# Altium schematic sheet NCS_Wireless_Bed_Unit_DIP_Conn_Prog_conn.SchDoc
size A
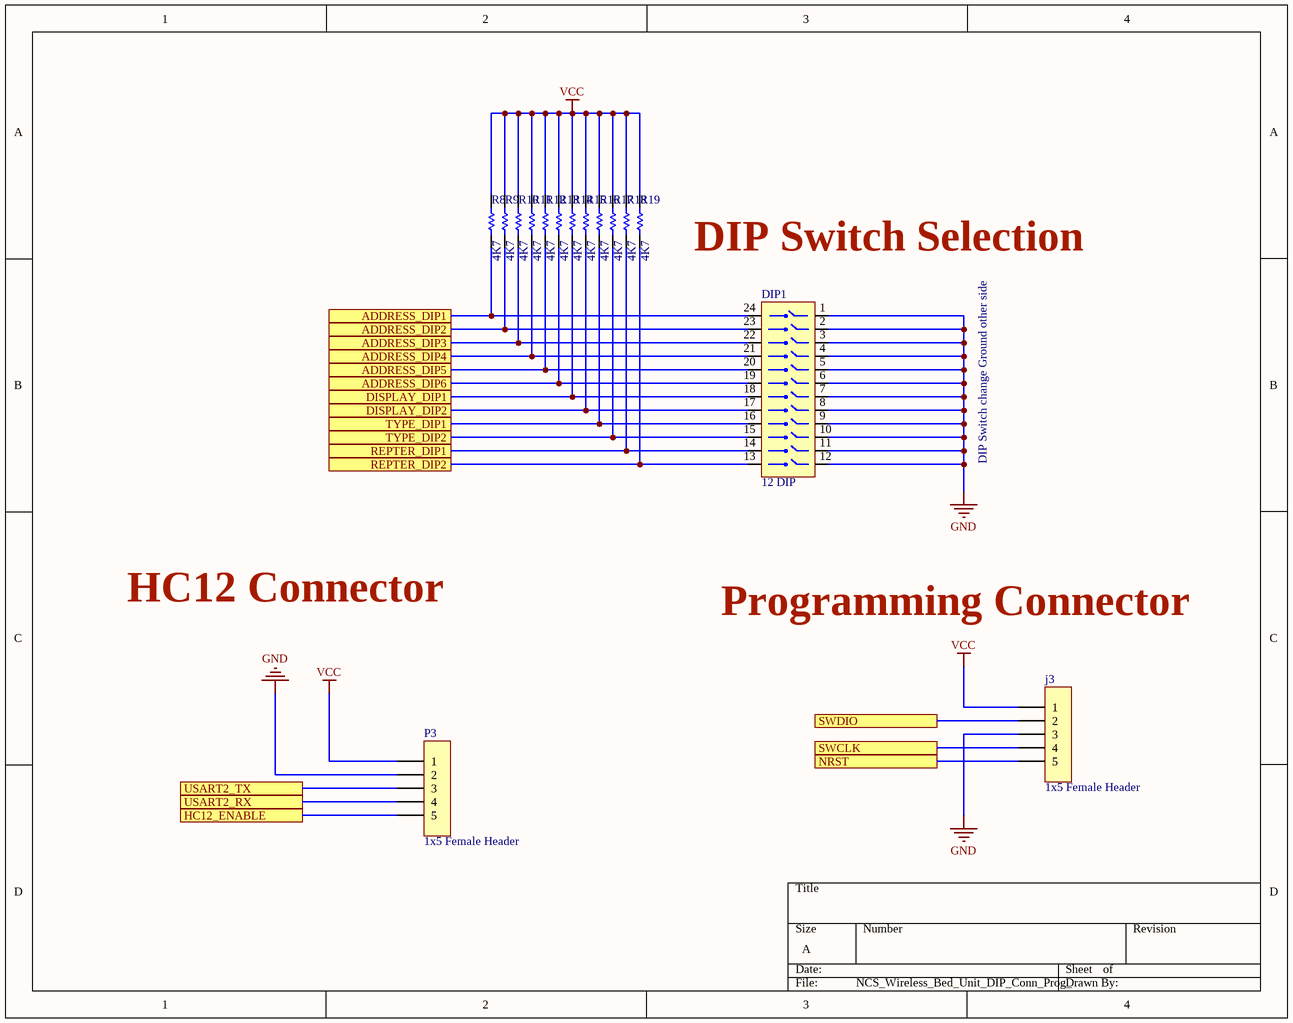
[diagram p0: NCS_Wireless_Bed_Unit_DIP_Conn_Prog_conn.SchDoc]

## Parts
DIP1  12 DIP  [DIP24]
j3  1x5 Female Header  [1x5 Female Header]
P3  1x5 Female Header  [1x5 Female Header]
R8  4K7  [RC0805FR-7W4K7L]
R9  4K7  [RC0805FR-7W4K7L]
R10  4K7  [RC0805FR-7W4K7L]
R11  4K7  [RC0805FR-7W4K7L]
R12  4K7  [RC0805FR-7W4K7L]
R13  4K7  [RC0805FR-7W4K7L]
R14  4K7  [RC0805FR-7W4K7L]
R15  4K7  [RC0805FR-7W4K7L]
R16  4K7  [RC0805FR-7W4K7L]
R17  4K7  [RC0805FR-7W4K7L]
R18  4K7  [RC0805FR-7W4K7L]
R19  4K7  [RC0805FR-7W4K7L]

## Ports
ADDRESS_DIP1, ADDRESS_DIP2, ADDRESS_DIP3, ADDRESS_DIP4, ADDRESS_DIP5, ADDRESS_DIP6, DISPLAY_DIP1, DISPLAY_DIP2, HC12_ENABLE, NRST, REPTER_DIP1, REPTER_DIP2, SWCLK, SWDIO, TYPE_DIP1, TYPE_DIP2, USART2_RX, USART2_TX

## Nets
GND: DIP1.1 DIP1.2 DIP1.3 DIP1.4 DIP1.5 DIP1.6 DIP1.7 DIP1.8 DIP1.9 DIP1.10 DIP1.11 DIP1.12 j3.3 P3.2
VCC: j3.1 P3.1 R8.1 R9.1 R10.1 R11.1 R12.1 R13.1 R14.1 R15.1 R16.1 R17.1 R18.1 R19.1
ADDRESS_DIP1: DIP1.24 R8.2 ; port ADDRESS_DIP1
ADDRESS_DIP2: DIP1.23 R9.2 ; port ADDRESS_DIP2
ADDRESS_DIP3: DIP1.22 R10.2 ; port ADDRESS_DIP3
ADDRESS_DIP4: DIP1.21 R11.2 ; port ADDRESS_DIP4
ADDRESS_DIP5: DIP1.20 R12.2 ; port ADDRESS_DIP5
ADDRESS_DIP6: DIP1.19 R13.2 ; port ADDRESS_DIP6
DISPLAY_DIP1: DIP1.18 R14.2 ; port DISPLAY_DIP1
DISPLAY_DIP2: DIP1.17 R15.2 ; port DISPLAY_DIP2
HC12_ENABLE: P3.5 ; port HC12_ENABLE
NRST: j3.5 ; port NRST
REPTER_DIP1: DIP1.14 R18.2 ; port REPTER_DIP1
REPTER_DIP2: DIP1.13 R19.2 ; port REPTER_DIP2
SWCLK: j3.4 ; port SWCLK
SWDIO: j3.2 ; port SWDIO
TYPE_DIP1: DIP1.16 R16.2 ; port TYPE_DIP1
TYPE_DIP2: DIP1.15 R17.2 ; port TYPE_DIP2
USART2_RX: P3.4 ; port USART2_RX
USART2_TX: P3.3 ; port USART2_TX

## Notes on the sheet
- DIP Switch Selection
- DIP Switch change Ground other side
- HC12 Connector
- Programming Connector

## Library data of the parts
DIP1 = 12 Way 2.54MM DIP switch - SUNROM
j3 P3 = M20-9990546: 2.54mm (0.1) Pitch SIL Vertical PC Tail Pin Header, 6.1mm mating pin height, tin, 5 contacts"; Manufacturer: Harwin; Number of Contacts: 5; Current Rating: 3A; Gender: Male; Insulation Resistance: 10GR; Voltage Rating (DC): 750V; Mated Stacking Heights: 16.54mm; Supplier: Digikey; Supplier Part Number: 952-2268-ND; Manufacturer Part Number: M20-9990546; RoHS: Yes; Category: Headers and Wire Housings; Stock: 16218; Pricing: 1=0.2, 10=0.163, 100=0.1329, 500=0.11516, 1000=0.10828, 5000=0.09388, 10000=0.08828 (USD); Mounting Technology: Through Hole; Case/Package: SIL; Contact Material: Brass,Bronze; Contact Plating: Tin; Contact Shape: Square; Contact Finish - Mating: TIN; Insulation Material: Nylon; Insulation Color: Black; Min Operating Temperature: -40°C; Max Operating Temperature: 105°C; Number of Rows: 1; Termination: Solder; Package Quantity: 1000; Packaging: Bulk; Number of Positions: 5; Orientation: Straight; Series: M20; Contact Type: Male Pin; Fastening Type: Pull; Pitch: 2.54mm; Reach SVHC Compliant: No; RoHS Compliant: Yes; Flammability Rating: UL94 V-0; ComponentLink1URL: https://datasheet.ciiva.com/11749/0900766b80da602d-11749062.pdf?src-supplier=Rs; ComponentLink1Description: https://datasheet.ciiva.com/11749/0900766b80da602d-11749062.pdf?src-supplier=Rs; ComponentLink2URL: https://datasheet.ciiva.com/6833/m20-999-6833320.pdf?src-supplier=Digikey; ComponentLink2Description: https://datasheet.ciiva.com/6833/m20-999-6833320.pdf?src-supplier=Digikey; ComponentLink3URL: https://datasheet.ciiva.com/8046/315376-8046940.pdf?src-supplier=Element14; ComponentLink3Description: https://datasheet.ciiva.com/8046/315376-8046940.pdf?src-supplier=Element14
R8-R19 = RC0805FR-7W4K7L: SMD Chip Resistor, 4.7 kOhm, ± 1%, 250 mW, 0805 [2012 Metric], Thick Film, General Purpose; Manufacturer: Yageo; Supplier: Digikey; Supplier Part Number: 13-RC0805FR-7W4K7LCT-ND; Manufacturer Part Number: RC0805FR-7W4K7L; RoHS: Yes; Category: Chip SMD Resistors; Stock: 8233; Pricing: 1=0.17, 10=0.06, 50=0.0484, 100=0.0367, 500=0.03468, 1000=0.03264 (USD); RoHS Compliant: Yes